# Altium schematic sheet Sheet1.SchDoc
size A4; SheetNumber: 1; SheetTotal: 1
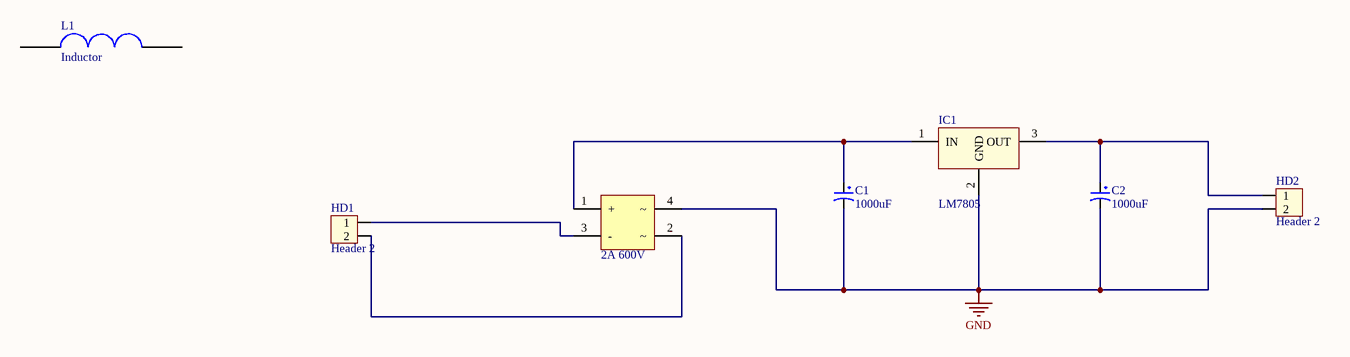
[diagram p0: Sheet1.SchDoc]

## Parts
C1  1000uF  [tu hoa 13mm]
C2  1000uF  [tu hoa 13mm]
D1  2A 600V  [DIODE CAU 2A 3A CAM]
HD1  Header 2  [HED2]
HD2  Header 2  [HED2]
IC1  LM7805  [QTO-220]
L1  Inductor  [Inductor]

## Nets
GND: C1.2 C2.2 D1.4 HD2.2 IC1.2(GND)
NetC1_1: C1.1 D1.1(+) IC1.1(IN)
NetC2_1: C2.1 HD2.1 IC1.3(OUT)
NetD1_2: D1.2 HD1.2
NetD1_3: D1.3(-) HD1.1

Not connected (* = marked no-connect by the designer): L1 1 2

## Library data of the parts
C1 C2 = Tu Hoa 1000uF 50V 13x26: Cắm; Don_Vi: Con; So_Chan: 2; Ten_Linh_Kien: Tụ Hóa 1000uF 50V; Ma_Hang: MH006619; Chung_Loai: Cắm; Kieu_Chan: *
D1 = Diode CAU 2A VUONG: Cắm; Ten_Linh_Kien: Diode Cầu 2A 600V KBP206 Vuông; Don_Vi: Con; Ma_Hang: MH001206; Ghi_Chu: *; Kieu_Chan: *; Chung_Loai: Cắm
HD1 HD2 = Hed2: Header 2 (Green); Value: Header 2
IC1 = LM78xx: On ap +, from + 5 to + 24VDC; Value: LM7805